# EAGLE design Ham-Dip (EAGLE 8.2.1)
VCC: 5v
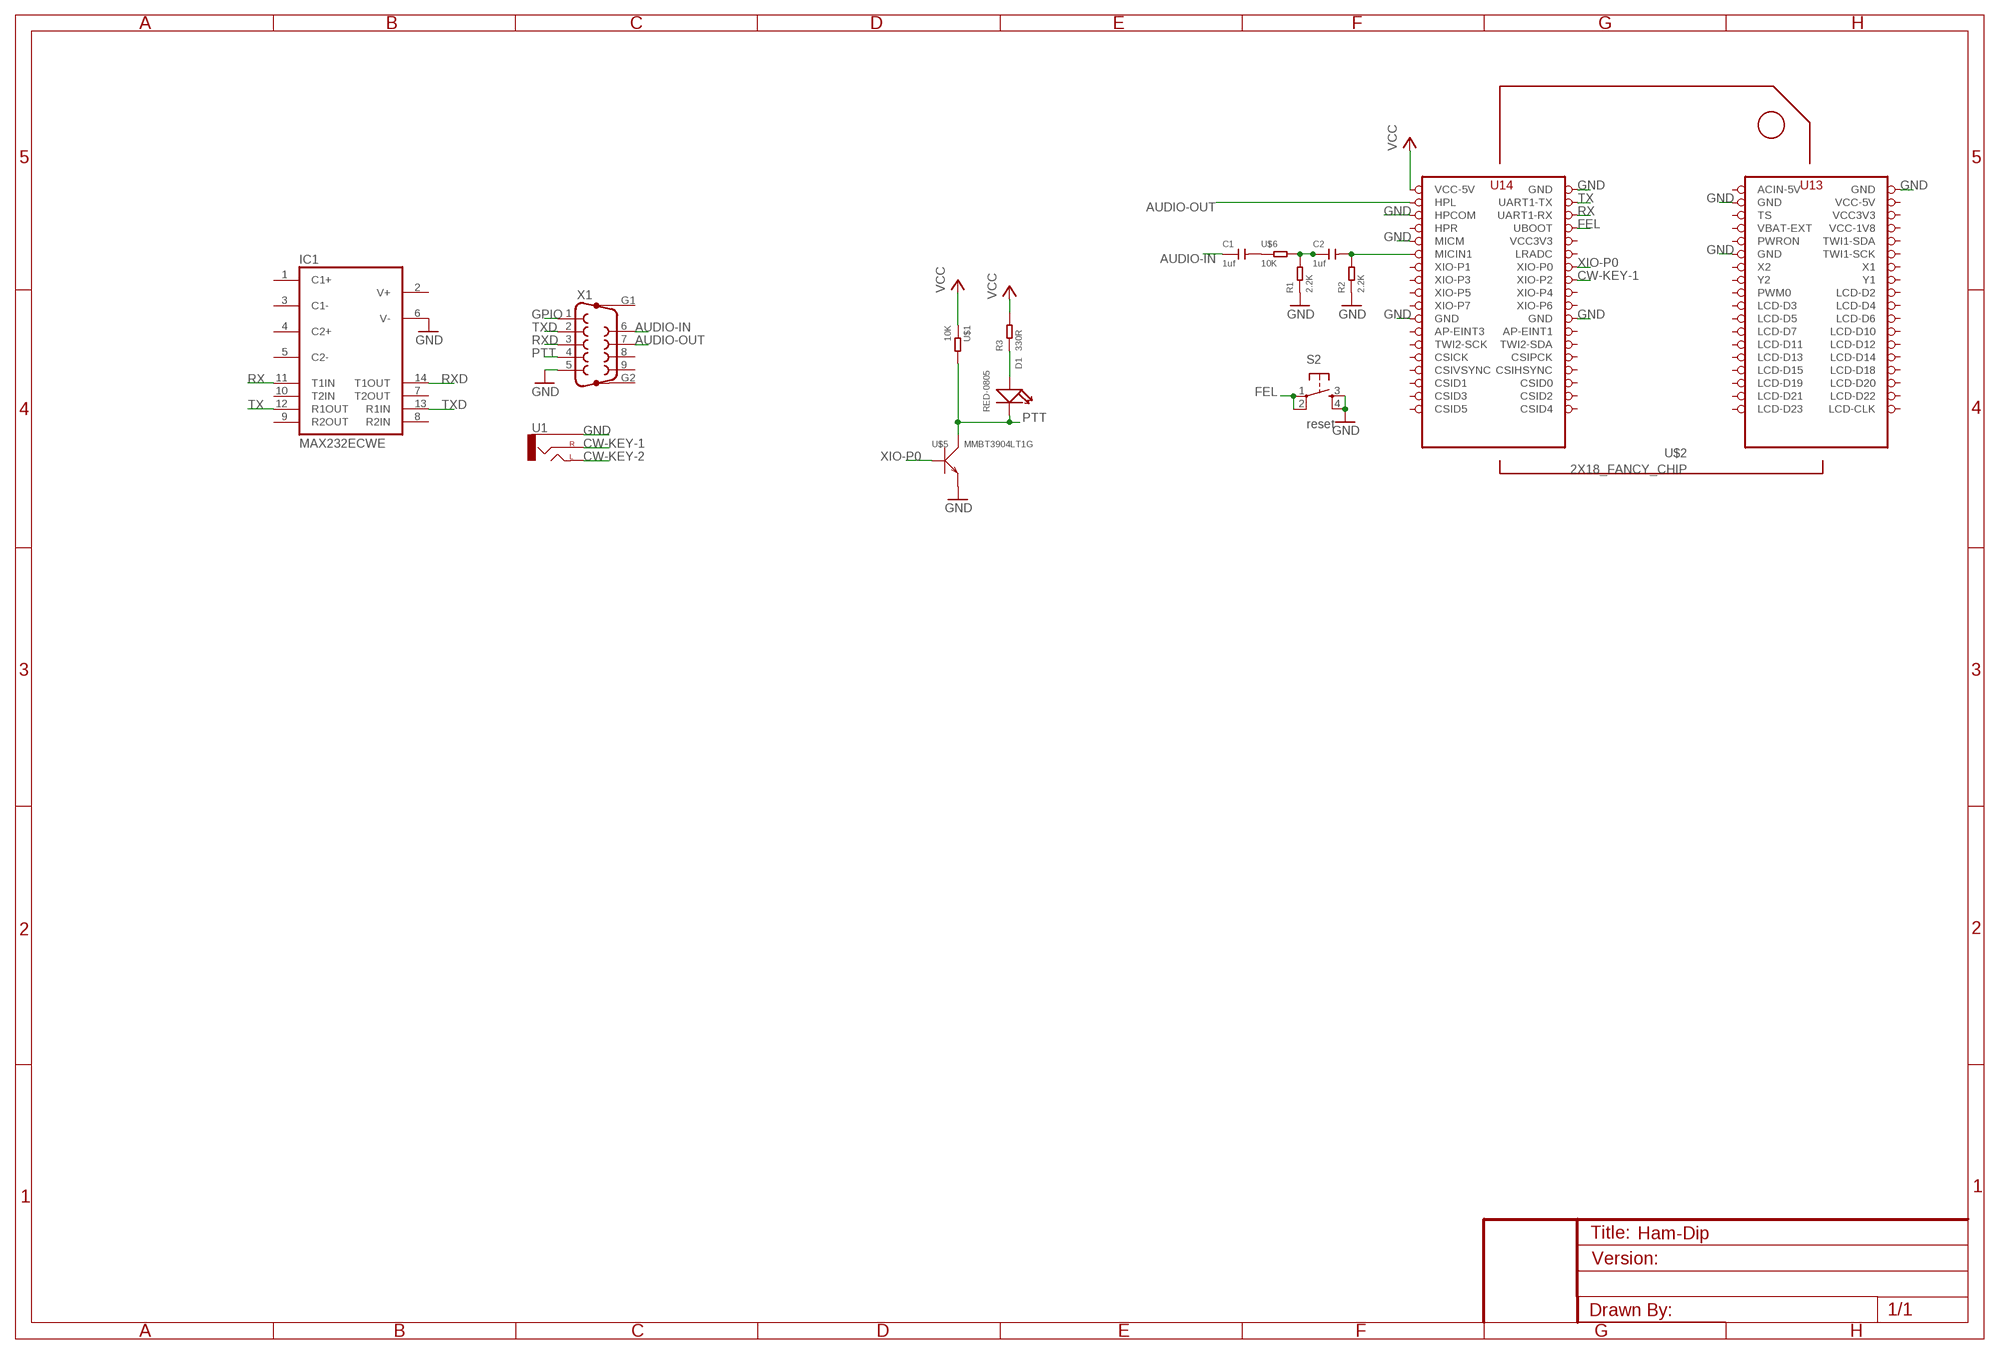
[diagram p0: schematic, sheet 1]

## Parts
C1  1uf  CERAMIC-1UF-25V-10%-X7R(0603)  [C0603]
C2  1uf  CERAMIC-1UF-25V-10%-X7R(0603)  [C0603]
D1  RED-0805  SMD-LED-CLEAR-RED(0805)  [LED-0805]
IC1  MAX232ECWE  [SO16L]
R1  2.2K  SMD-RES-2.2K-5%-1/8W(0805)  [R0805]
R2  2.2K  SMD-RES-2.2K-5%-1/8W(0805)  [R0805]
R3  330R  SMD-RES-220R-5%-1/8W(0805)  [R0805]
S2  reset  TAC_SWITCHSMD  [TACTILE_SWITCH_SMD]
U1  AUDIO-JACKPTH  [AUDIO-JACK]
U$1  10K  SMD-RES-10K-1%-1/8W(0805)  [R0805]
U$2  2X18_FANCY_CHIP  [2X18_FANCY_EDGE_CHIP_TH]
U$5  MMBT3904LT1G  SMD-TRANSISTORS-NPN-40V-200MA-MMBT3904LT1G(SOT-23)  [SOT-23]
U$6  10K  SMD-RES-10K-1%-1/8W(0805)  [R0805]
X1  F09HP  [F09HP]

## Nets
AUDIO-IN: C1.1 X1.6
AUDIO-OUT: U$2.70(HPL) X1.7
CW-KEY-1: U1.RING(RIGHT) U$2.57(XIO-P2)
CW-KEY-2: U1.TIP(LEFT)
FEL: S2.1 S2.2 U$2.65(UBOOT)
GND: IC1.6(V-) R1.1 R2.1 S2.3 S2.4 U1.SLEEVE U$2.26(GND) U$2.34(GND) U$2.35(GND) U$2.51(GND) U$2.52(GND) U$2.64(MICM) U$2.68(HPCOM) U$2.71(GND) U$5.2(E) X1.5
GPIO: X1.1
MIC-IN: C2.2 R2.2 U$2.62(MICIN1)
N$1: D1.+ R3.1
N$3: C1.2 U$6.1
N$4: C2.1 R1.2 U$6.2
PTT: D1.- U$1.2 U$5.3(C) X1.4
RX: IC1.11(T1IN) U$2.67(UART1-RX)
RXD: IC1.14(T1OUT) X1.3
TX: IC1.12(R1OUT) U$2.69(UART1-TX)
TXD: IC1.13(R1IN) X1.2
VCC: R3.2 U$1.1 U$2.72(VCC-5V)
XIO-P0: U$2.59(XIO-P0) U$5.1(B)
Unconnected: IC1.1(C1+) IC1.2(V+) IC1.3(C1-) IC1.4(C2+) IC1.5(C2-) IC1.7(T2OUT) IC1.8(R2IN) IC1.9(R2OUT) IC1.10(T2IN) U$2.1(LCD-CLK) U$2.2(LCD-D23) U$2.3(LCD-D22) U$2.4(LCD-D21) U$2.5(LCD-D20) U$2.6(LCD-D19) U$2.7(LCD-D18) U$2.8(LCD-D15) U$2.9(LCD-D14) U$2.10(LCD-D13) U$2.11(LCD-D12) U$2.12(LCD-D11) U$2.13(LCD-D10) U$2.14(LCD-D7) U$2.15(LCD-D6) U$2.16(LCD-D5) U$2.17(LCD-D4) U$2.18(LCD-D3) U$2.19(LCD-D2) U$2.20(PWM0) U$2.21(Y1) U$2.22(Y2) U$2.23(X1) U$2.24(X2) U$2.25(TWI1-SCK) U$2.27(TWI1-SDA) U$2.28(PWRON) U$2.30(VBAT-EXT) U$2.32(TS) U$2.36(ACIN-5V) U$2.37(CSID4) U$2.38(CSID5) U$2.39(CSID2) U$2.40(CSID3) U$2.41(CSID0) U$2.42(CSID1) U$2.43(CSIHSYNC) U$2.44(CSIVSYNC) U$2.45(CSIPCK) U$2.46(CSICK) U$2.47(TWI2-SDA) U$2.48(TWI2-SCK) U$2.49(AP-EINT1) U$2.50(AP-EINT3) U$2.53(XIO-P6) U$2.54(XIO-P7) U$2.55(XIO-P4) U$2.56(XIO-P5) U$2.58(XIO-P3) U$2.60(XIO-P1) U$2.61(LRADC) U$2.66(HPR) X1.8 X1.9 X1.G1 X1.G2

## Power pins joined to a net without a drawn wire
GND: IC1.15(GND)
VCC: IC1.16(VCC)
VCC3V3: U$2.31(VCC3V3) U$2.63(VCC3V3)
VCC-1V8: U$2.29(VCC-1V8)
VCC-5V: U$2.33(VCC-5V)

## Library data of the parts
C1 C2 = Seeed-Capacitor-2016:CERAMIC-1UF-25V-10%-X7R(0603): 302010139; MPN: CC0603KRX7R8BB105
D1 = Seeed-LED-2016:SMD-LED-CLEAR-RED(0805): 304090046; MPN: 17-215SURC/S530-A2/TR8
IC1 = maxim:MAX232ECWE: RS232 TRANSCEIVER; MF: MAXIM; MPN: MAX232ECWE+; OC_FARNELL: 9724435; OC_NEWARK: 67K4440
R1 R2 = Seeed-Resistor-2016:SMD-RES-2.2K-5%-1/8W(0805): 301010333; MPN: RC0805JR-072K2L
R3 = Seeed-Resistor-2016:SMD-RES-220R-5%-1/8W(0805): 301010315; MPN: RC0805JR-07220RL; VALUE: 220R
S2 = SparkFun-Electromechanical:TAC_SWITCH: Momentary Switch Button commonly used for reset or general input. Spark Fun Electronics SKU : COM-00097 SMT- SWCH-08247; PROD_ID: SWCH-08247
U1 = SparkFun-Connectors:AUDIO-JACK: 3.5mm Audio Jack Simple 3.5mm common PCB mount audio jack. SKU: PRT-08032
U$1 U$6 = Seeed-Resistor-2016:SMD-RES-10K-1%-1/8W(0805): 301010361; MPN: RC0805FR-0710KL
U$2 = JKW_CHIP:2X18_FANCY_CHIP
U$5 = Seeed-Transistor-2016:SMD-TRANSISTORS-NPN-40V-200MA-MMBT3904LT1G(SOT-23): 305010013; MPN: MMBT3904LT1G
X1 = con-subd:F09HP: SUB-D; OC_FARNELL: unknown; OC_NEWARK: unknown

## Board
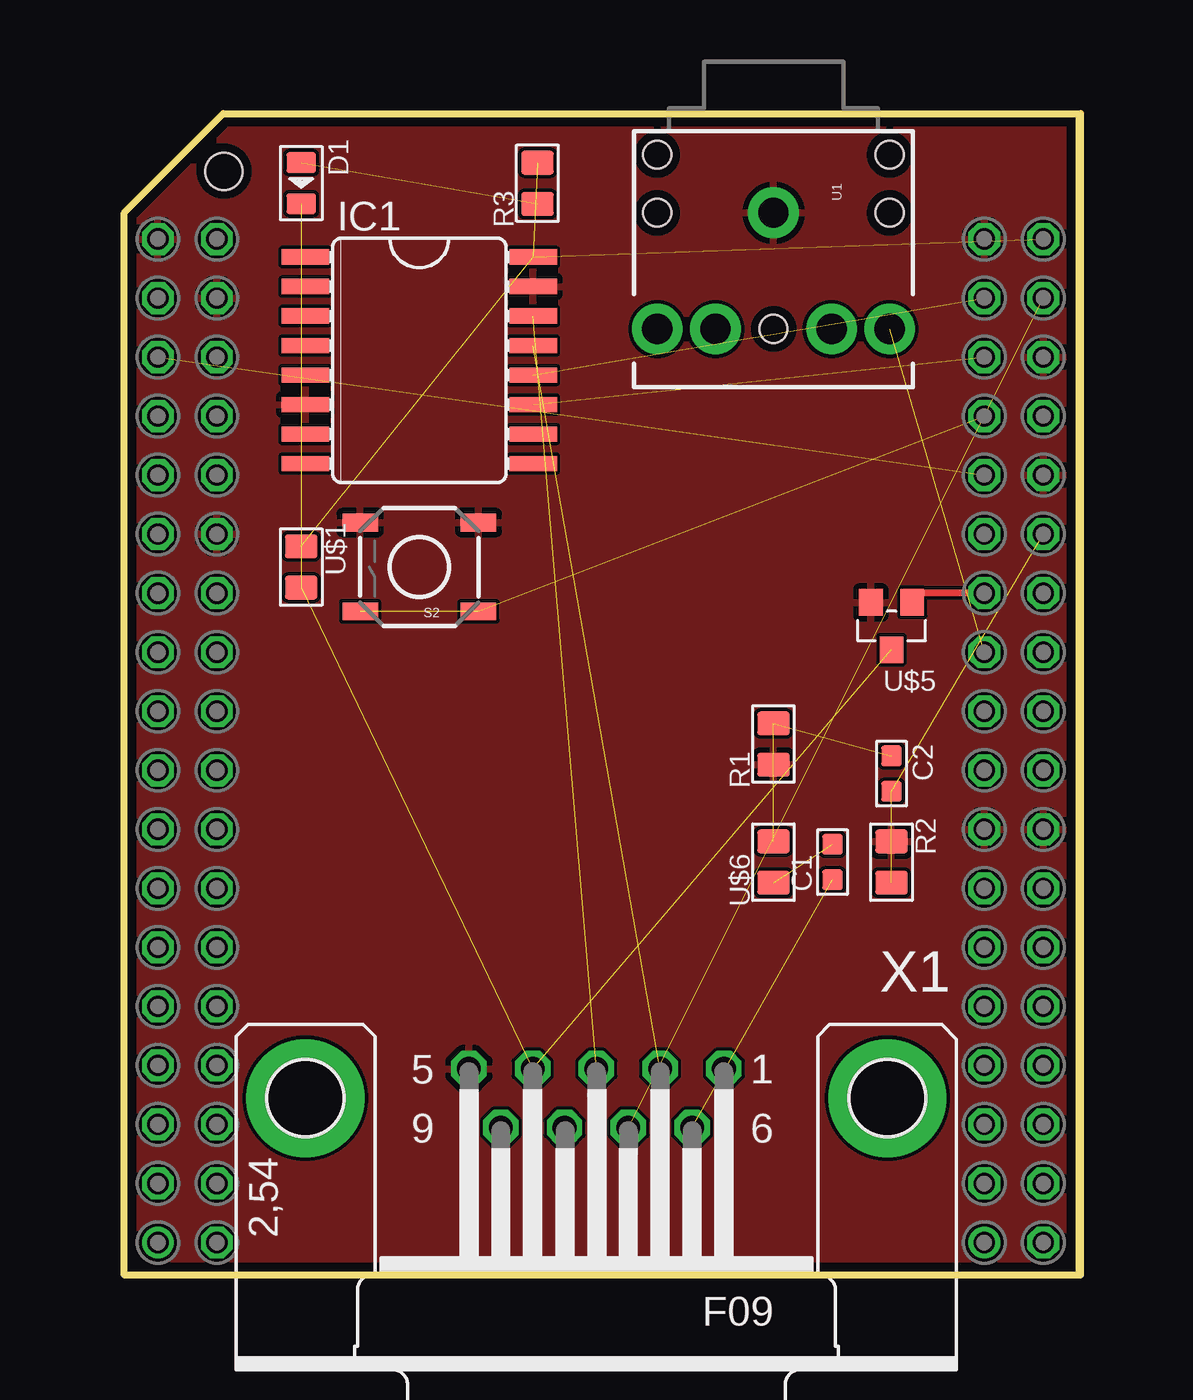
[diagram p1: board, top side]
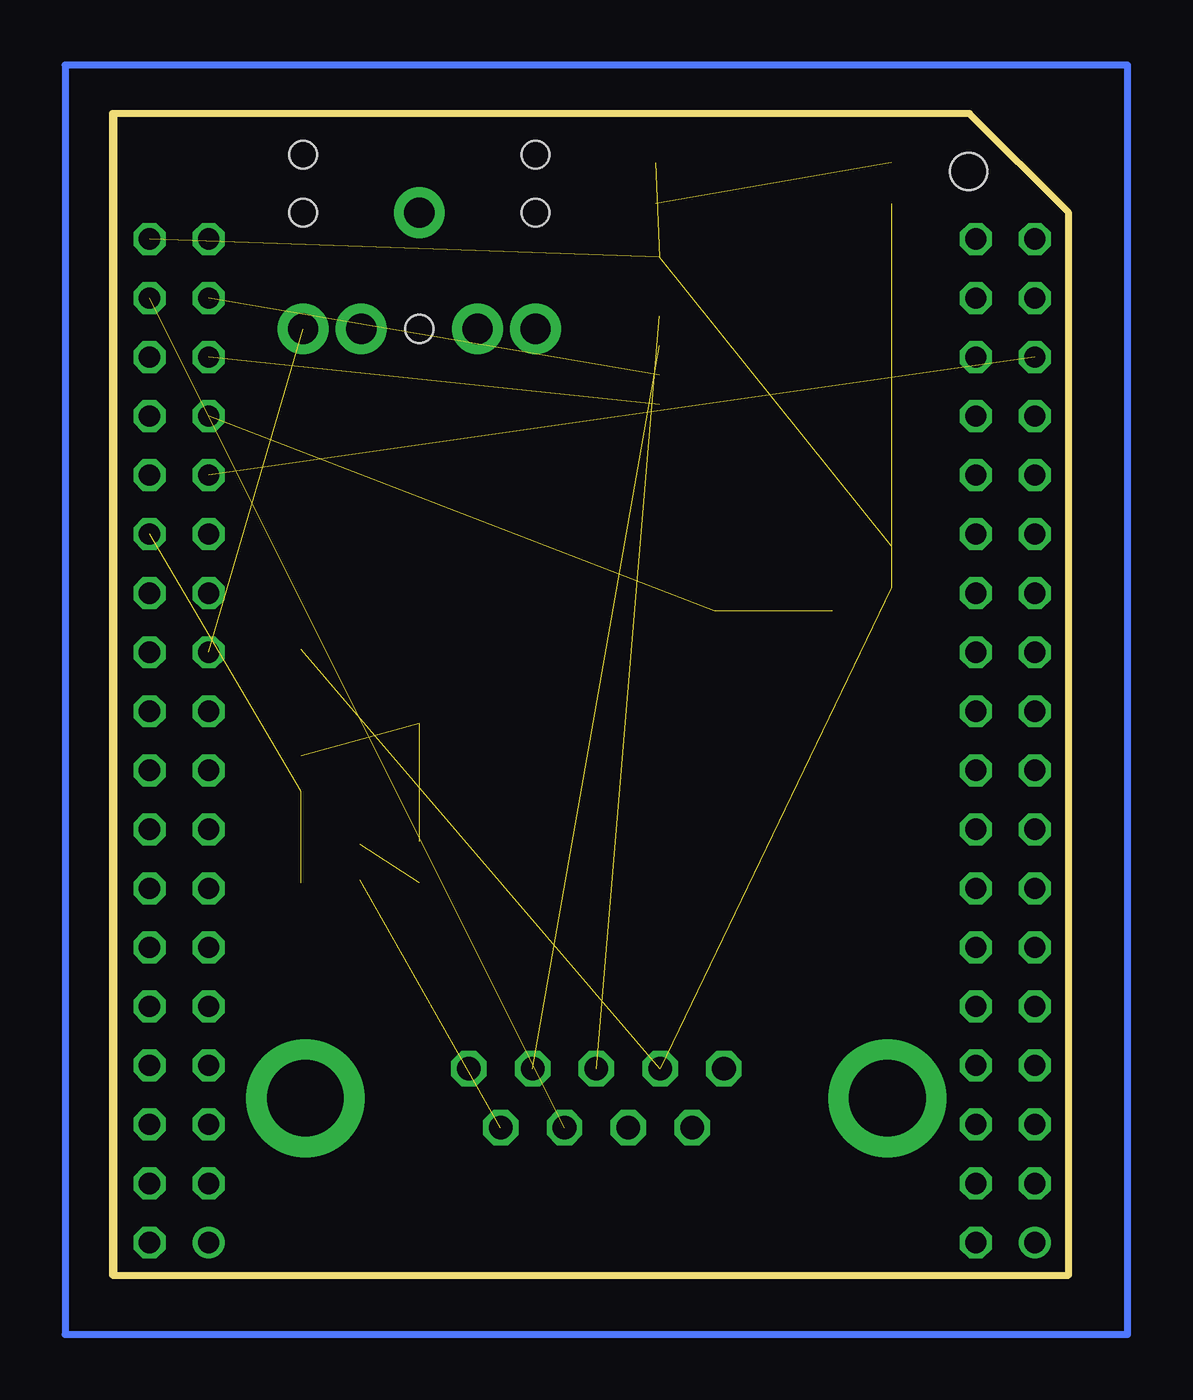
[diagram p2: board, bottom side, seen from below]

Size 41.15 x 50 mm. Coordinates in mm from the lower left corner, seen from the top.
Outline: 0,0 0,45.72 4.27,49.99 41.15,49.99 41.15,0 0,0
Copper layers (1*16): Top 0.0356mm / dielectric 1.5011mm / Bottom 0.0356mm
Design rules "LaenPCBOrder": minimum track width 6mil, minimum drill 13mil, track to track 6mil, track to pad 6mil, pad to pad 6mil, via to via 6mil, smd to smd 6mil, copper to edge 15mil, drill to drill 6mil, minimum pad ring 7mil, minimum via ring 7mil, stop-mask expansion 4mil, vias tented up to drill 0mil, thermal gap 10mil

### Footprints (pad centres in the part's own frame; a part is rotated, then mirrored left to right if it is on the bottom)
C0603 = smd 0.889 x 0.889: 1 0,0.762; 2 0,-0.762
LED-0805 = smd 0.889 x 1.27: + -0.889,0; - 0.889,0
SO16L = smd 0.66 x 2.032: 1 -4.445,-4.902; 2 -3.175,-4.902; 3 -1.905,-4.902; 4 -0.635,-4.902; 5 0.635,-4.902; 6 1.905,-4.902; 7 3.175,-4.902; 8 4.445,-4.902; 9 4.445,4.902; 10 3.175,4.902; 11 1.905,4.902; 12 0.635,4.902; 13 -0.635,4.902; 14 -1.905,4.902; 15 -3.175,4.902; 16 -4.445,4.902
R0805 = smd 1.397 x 1.016: 1 0,0.889; 2 0,-0.889
TACTILE_SWITCH_SMD = smd 1.524 x 0.762: 1 -2.54,1.905; 2 2.54,1.905; 3 -2.54,-1.905; 4 2.54,-1.905
AUDIO-JACK = drill 1.3 pad 2.184: RING 5,5; RSH 5,2.5; SLEEVE 0,0; TIP 5,-5; TSH 5,-2.5 | hole 1.2: 0,5; -2.5,5; -2.5,-5; 0,-5; 5,0
2X18_FANCY_EDGE_CHIP_TH = drill 0.914: 1 1.45,1.41; 37 37.01,1.41 | drill 0.914 octagon: 2 3.99,1.41; 3 1.45,3.95; 4 3.99,3.95; 5 1.45,6.49; 6 3.99,6.49; 7 1.45,9.03; 8 3.99,9.03; 9 1.45,11.57; 10 3.99,11.57; 11 1.45,14.11; 12 3.99,14.11; 13 1.45,16.65; 14 3.99,16.65; 15 1.45,19.19; 16 3.99,19.19; 17 1.45,21.73; 18 3.99,21.73; 19 1.45,24.27; 20 3.99,24.27; 21 1.45,26.81; 22 3.99,26.81; 23 1.45,29.35; 24 3.99,29.35; 25 1.45,31.89; 26 3.99,31.89; 27 1.45,34.43; 28 3.99,34.43; 29 1.45,36.97; 30 3.99,36.97; 31 1.45,39.51; 32 3.99,39.51; 33 1.45,42.05; 34 3.99,42.05; 35 1.45,44.59; 36 3.99,44.59; 38 39.55,1.41; 39 37.01,3.95; 40 39.55,3.95; 41 37.01,6.49; 42 39.55,6.49; 43 37.01,9.03; 44 39.55,9.03; 45 37.01,11.57; 46 39.55,11.57; 47 37.01,14.11; 48 39.55,14.11; 49 37.01,16.65; 50 39.55,16.65; 51 37.01,19.19; 52 39.55,19.19; 53 37.01,21.73; 54 39.55,21.73; 55 37.01,24.27; 56 39.55,24.27; 57 37.01,26.81; 58 39.55,26.81; 59 37.01,29.35; 60 39.55,29.35; 61 37.01,31.89; 62 39.55,31.89; 63 37.01,34.43; 64 39.55,34.43; 65 37.01,36.97; 66 39.55,36.97; 67 37.01,39.51; 68 39.55,39.51; 69 37.01,42.05; 70 39.55,42.05; 71 37.01,44.59; 72 39.55,44.59 | hole 1.6: 4.3,47.5
SOT-23 = smd 1.016 x 1.143: 1 -0.889,-1.016; 2 0.889,-1.016; 3 0,1.016
F09HP = drill 1.016 octagon: 1 -5.486,-1.27; 2 -2.743,-1.27; 3 0,-1.27; 4 2.743,-1.27; 5 5.486,-1.27; 6 -4.115,1.27; 7 -1.372,1.27; 8 1.372,1.27; 9 4.115,1.27 | drill 3.302 pad 5.08: G1 -12.522,0; G2 12.522,0

### Placement (x,y rotation side)
C1  30.48,17.78 180 top
C2  33.02,21.59 0 top
D1  7.62,46.99 270 top
IC1  12.7,39.37 270 top
R1  27.94,22.86 180 top
R2  33.02,17.78 0 top
R3  17.78,46.99 180 top
S2  12.7,30.48 180 top
U1  27.94,45.72 270 top
U$1  7.62,30.48 0 top
U$2  0,0 0 top
U$5  33.02,27.94 180 top
U$6  27.94,17.78 180 top
X1  20.32,7.62 180 top

### Tracks (layer width: path | path; a pad name or v marks a point on that pad's centre or on a via)
AUDIO-IN  (1 unrouted)
AUDIO-OUT  (1 unrouted)
CW-KEY-1  (1 unrouted)
FEL  (2 unrouted)
GND
  pour Top: -1.27,50.8 41.91,50.8 41.91,-1.27 -1.27,-1.27
MIC-IN  (2 unrouted)
N$1  (1 unrouted)
N$2
  Bottom 0.305: -2.54,52.07 43.18,52.07 43.18,-2.54 -2.54,-2.54 -2.54,52.07
N$3  (1 unrouted)
N$4  (2 unrouted)
PTT  (3 unrouted)
RX  (1 unrouted)
RXD  (1 unrouted)
TX  (1 unrouted)
TXD  (1 unrouted)
VCC  (3 unrouted)
VCC3V3  (1 unrouted)
XIO-P0
  Top 0.305: U$2.59 34.3,29.35 U$5.1